# Altium schematic sheet Sensor Interface.SchDoc: Titel
size A4; ApprovedBy: name; CompanyName: DCI Electronics bv; DrawnBy: KRS; Address1: Nijverheidsstraat 14; Address2: 4458 AV Eindewege; Address3: Phone: +31 (0)113 344880; DocumentNumber: 2; Revision: 0; SheetNumber: 3; SheetTotal: 5; PageSetup: Record=PageOptions|CenterHorizontal=True|CenterVertical=True|PrintScale=1.00|XCorrection=1.00|YCorrection=1.00|PrintKind=1|BorderSize=5000000|LeftOffset=0|BottomOffset=0|Orientation=2|PaperLength=1000|PaperWidth=1000|Scale=100|PaperSource=7|PrintQuality=-4|MediaType=1|DitherType=10|PaperKind=ISO_A4_(210.00_x_297.00_MM)|PrintScaleMode=1; SubTitle: SubTitel; ApprovedDate: 01-01-12; DesignedBy: KRS
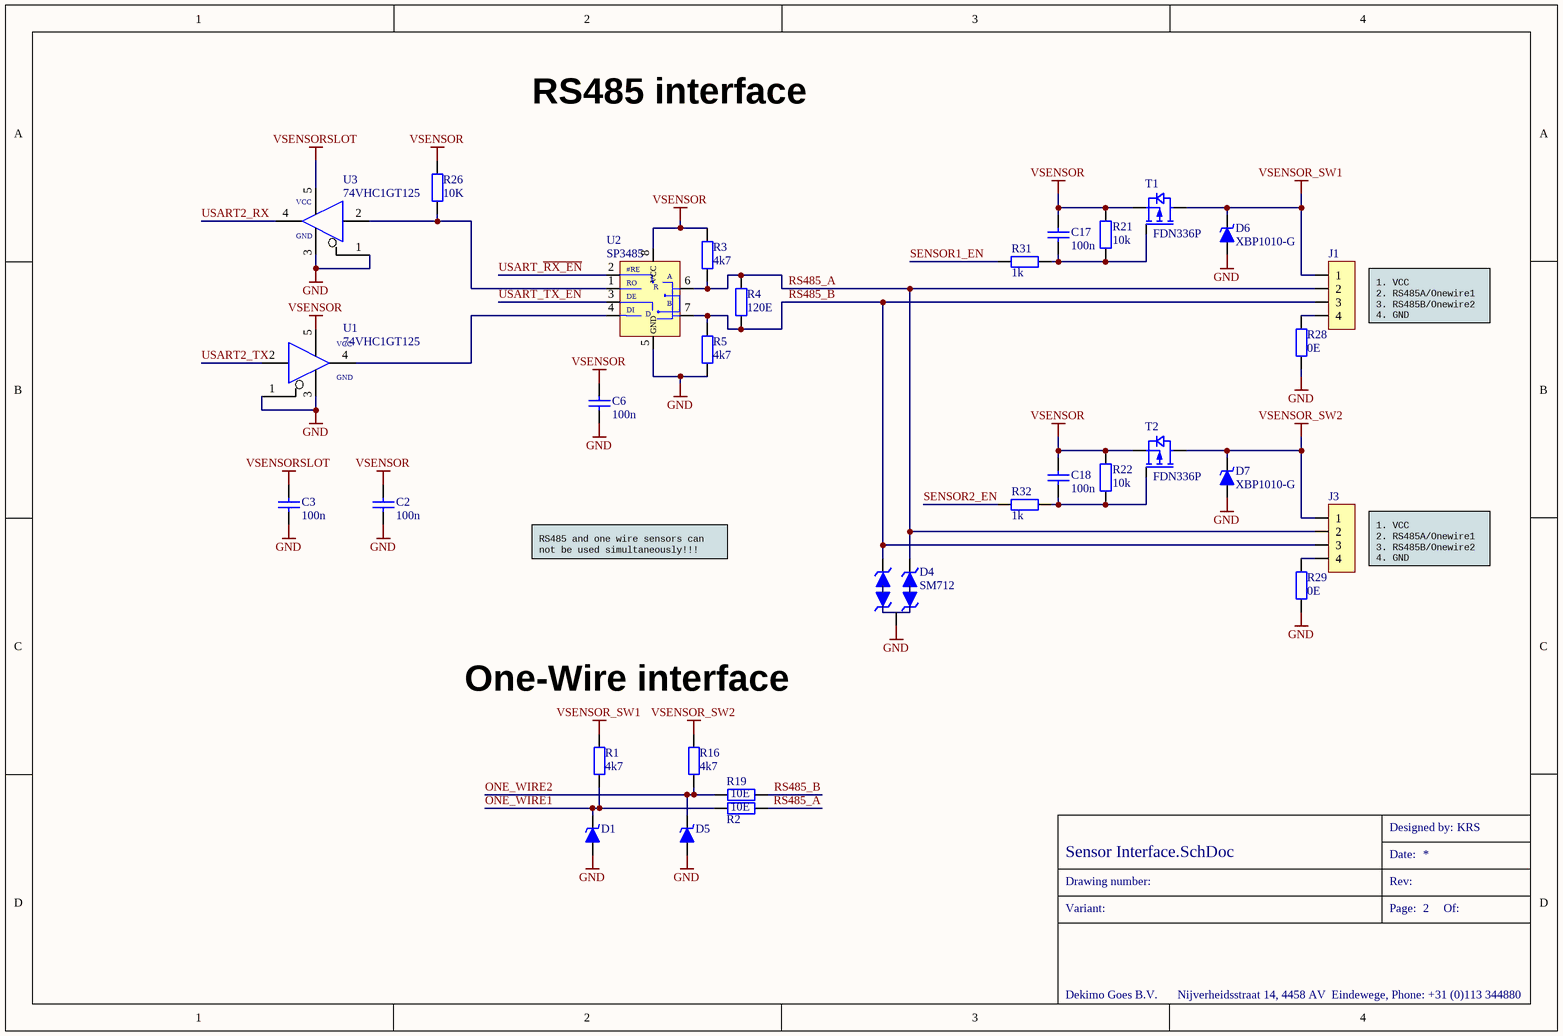
[diagram p0: Sensor Interface.SchDoc]

## Parts
C2  100n  [CAPC1608X09N]
C3  100n  [CAPC1608X09N]
C6  100n  [CAPC1608X09N]
C17  100n  [CAPC1608X09N]
C18  100n  [CAPC1608X09N]
D1  D3V3M1U2S9  [SOD946]  (value not drawn)
D4  SM712  [SOT95P245X110-C1C2C-3N]
D5  D3V3M1U2S9  [SOD946]  (value not drawn)
D6  XBP1010-G  [SODFL120X40-2N]
D7  XBP1010-G  [SODFL120X40-2N]
J1  4PIN  [WE_691322310004]  (value not drawn)
J3  4PIN  [WE_691322310004]  (value not drawn)
R1  4k7  [RESC1608X13N]
R2  10E  [RESC1608X13N]
R3  4k7  [RESC1608X13N]
R4  120E  [RESC1608X13N]
R5  4k7  [RESC1608X13N]
R16  4k7  [RESC1608X13N]
R19  10E  [RESC1608X13N]
R21  10k  [RESC1608X13N]
R22  10k  [RESC1608X13N]
R26  10K  [RESC1608X13N]
R28  0E  [RESC1608X13N]
R29  0E  [RESC1608X13N]
R31  1k  [RESC1005x04N]
R32  1k  [RESC1005x04N]
T1  FDN336P  [SOT95P245X110_GSD-3N]
T2  FDN336P  [SOT95P245X110_GSD-3N]
U1  74VHC1GT125  [SOT95P280X145-5N]
U2  SP3485  [SOIC127P600X175-8N]
U3  74VHC1GT125  [SOT95P280X145-5N]

## Nets
GND: C2.1 C3.1 C6.1 D1.A D4.C D5.A D6.A D7.A R5.1 R28.1 R29.1 U1.1(~{OE}) U1.3(GND) U2.5(GND) U3.1(~{OE}) U3.3(GND)
VSENSOR: C2.2 C6.2 C17.2 C18.2 R3.2 R21.2 R22.2 R26.2 T1.S T2.S U1.5(VDD) U2.8(VCC)
VSENSOR_SW1: D6.C J1.1 R1.2 T1.D
VSENSOR_SW2: D7.C J3.1 R16.2 T2.D
VSENSORSLOT: C3.2 U3.5(VDD)
ONE_WIRE1: D1.C R1.1 R2.2
ONE_WIRE2: D5.C R16.1 R19.2
RS485_A: D4.C2 J1.2 J3.2 R2.1 R3.1 R4.2 U2.6(A)
RS485_B: D4.C1 J1.3 J3.3 R4.1 R5.2 R19.1 U2.7(B)
SENSOR1_EN: R31.1
SENSOR2_EN: R32.1
USART2_RX: U3.4(Y)
USART2_TX: U1.2(A)
USART_~{RX_EN}: U2.2(~{RE})
USART_TX_EN: U2.3(DE)
NetC17_1: C17.1 R21.1 R31.2 T1.G
NetC18_1: C18.1 R22.1 R32.2 T2.G
NetJ1_4: J1.4 R28.2
NetJ3_4: J3.4 R29.2
NetR26_1: R26.1 U2.1(RO) U3.2(A)
NetU1_4: U1.4(Y) U2.4(DI)

## Notes on the sheet
- RS485 interface
- (near J1) 1. VCC
  2. RS485A/Onewire1
  3. RS485B/Onewire2
  4. GND
- RS485 and one wire sensors can not be used simultaneously!!!
- (near J3) 1. VCC
  2. RS485A/Onewire1
  3. RS485B/Onewire2
  4. GND
- One-Wire interface
- Designed by:
- Drawing number:
- Variant:
- Date:
- Page:
- Rev:
- Of:
- Dekimo Goes B.V.
- Nijverheidsstraat 14, 4458 AV  Eindewege, Phone: +31 (0)113 344880
- (in symbol IC 74VHC1GT125) VCC
- (in symbol IC MAX3485/ETSO) #RE; R; D

## Library data of the parts
C2 C3 C6 C17 C18 = CKE 100N/60: 100nF 50V 10% X7R; EngPartGrpMainCode: CAP; ManufactpartCode: CC0603KRX7R9BB104-YAG; Type: Capacitor ceramic SMD; Preferred: False; SMD_Flag: True; PartCode: CKE 100N/60
D1 D5 = DIO D3V3M1U2S9: TVS diode 3.3V unidirec; EngPartGrpMainCode: DIO; ManufactpartCode: D3V3M1U2S9-7-DIO; Type: Diode suppressor SMD; Preferred: False; SMD_Flag: True; PartCode: DIO D3V3M1U2S9
D4 = DIO SM712: 7/12V, 400W bidir.; EngPartGrpMainCode: DIO; ManufactpartCode: SM712-LTL; Type: Diode suppressor SMD; Preferred: False; SMD_Flag: True; PartCode: DIO SM712
D6 D7 = DIO XBP1010-G: TVS Unidirectional 5V 40w; EngPartGrpMainCode: DIO; ManufactpartCode: XBP1010-G-TOR; Type: Diode suppressor SMD; Preferred: False; SMD_Flag: True; PartCode: DIO XBP1010-G
J1 J3 = CON PTB4/31: PCB,BOX,RY1,PEN4,HA,P3.81; EngPartGrpMainCode: CONN; ManufactpartCode: 691322310004-WE; Preferred: False; PartCode: CON PTB4/31; Type: Plug-in term. block; SMD_Flag: False
R1 R3 R5 R16 = R 4K7/60: 4k7 100mW 1% 0603; EngPartGrpMainCode: RES; ManufactpartCode: RC0603FR-074K7L-YAG; Preferred: False; SMD_Flag: True; PartCode: R 4K7/60; Type: Resistor metalfilm SMD
R2 R19 = R 10E/60: 10E 0.1W 1%; EngPartGrpMainCode: RES; ManufactpartCode: RC0603FR-0710RL-YAG; Preferred: False; SMD_Flag: True; PartCode: R 10E/60; Type: Resistor metalfilm SMD
R4 = R 120E/60: 120E 0.1W 1%; EngPartGrpMainCode: RES; ManufactpartCode: RC0603FR-07120RL-YAG; Preferred: False; SMD_Flag: True; PartCode: R 120E/60; Type: Resistor metalfilm SMD
R21 R22 = R 10K/60: 10kΩ 100mW 1%; EngPartGrpMainCode: RES; ManufactpartCode: RC0603FR-0710KL-YAG; Preferred: True; PartCode: R 10K/60; Type: Resistor metalfilm SMD; SMD_Flag: True
R26 = R 10K/60: 10k 100mW, 1%; EngPartGrpMainCode: RES; ManufactpartCode: RC0603FR-0710KL-YAG; Preferred: True; PartCode: R 10K/60; Type: Resistor metalfilm SMD; SMD_Flag: True
R28 R29 = R 0E/60: 0Ω 100mW 1%; PartCode: R 0E/60; EngPartGrpMainCode: RES; ManufactpartCode: RC0603FR-070RL-YAG; Preferred: True; Type: Resistor metalfilm SMD; SMD_Flag: True
R31 R32 = R 1K/70: 1kΩ 62.5mW 1%; PartCode: R 1K/70; EngPartGrpMainCode: RES; ManufactpartCode: RC0402FR-071KL-YAG; Preferred: False; SMD_Flag: True; Type: Resistor metalfilm SMD
T1 T2 = TRA FDN336P: 20V 1.3A 200mΩ logic level; EngPartGrpMainCode: TRAN; ManufactpartCode: FDN336P-FCH; Type: FET P-channel SMD; Preferred: False; SMD_Flag: True; PartCode: TRA FDN336P
U1 U3 = IC 74VHC1GT125: buffer/ levelshifter; EngPartGrpMainCode: IC; ManufactpartCode: M74VHC1GT125DT1G-ONS; Preferred: False; SMD_Flag: True; PartCode: IC 74VHC1GT125; Type: IC interface SMD
U2 = IC MAX3485/ETSO: RS485/RS422, 3v3, 10Mbps; EngPartGrpMainCode: IC; ManufactpartCode: SP3485EN-L-SIP; Preferred: False; SMD_Flag: True; PartCode: IC MAX3485/ETSO; Type: IC interface SMD